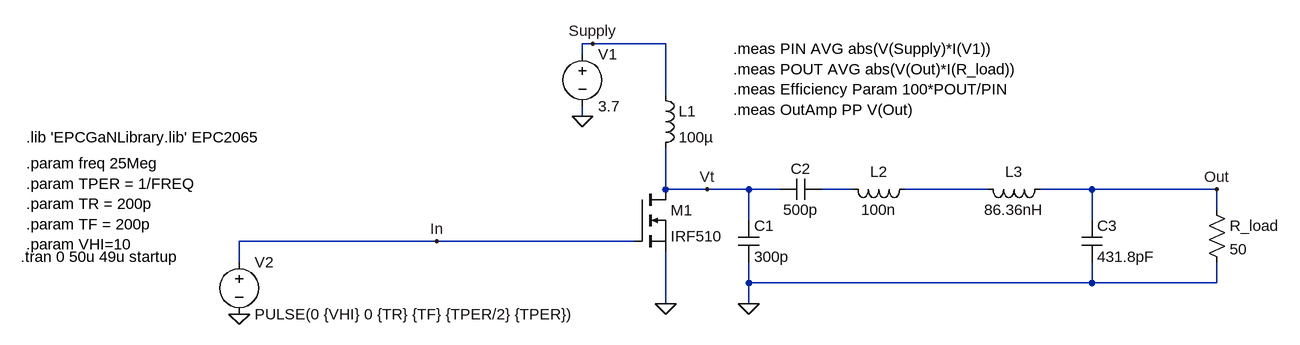
[diagram p0: schematic Class_E_rev1.asc]
Class_E_rev1.asc, the LTspice schematic file:
Version 4.1
SHEET 1 1096 800
WIRE 32 -96 16 -96
WIRE 144 -96 32 -96
WIRE 16 -80 16 -96
WIRE 144 -16 144 -96
WIRE 16 16 16 0
WIRE 144 128 144 64
WIRE 208 128 144 128
WIRE 272 128 208 128
WIRE 320 128 272 128
WIRE 432 128 384 128
WIRE 640 128 512 128
WIRE 800 128 720 128
WIRE 992 128 800 128
WIRE 992 160 992 128
WIRE 272 176 272 128
WIRE 800 176 800 128
WIRE -208 208 -512 208
WIRE 96 208 -208 208
WIRE -512 240 -512 208
WIRE 272 272 272 240
WIRE 800 272 800 240
WIRE 800 272 272 272
WIRE 992 272 992 240
WIRE 992 272 800 272
WIRE 144 304 144 224
WIRE 272 304 272 272
FLAG 16 16 0
FLAG -512 320 0
FLAG 272 304 0
FLAG -208 208 In
FLAG 208 128 Vt
FLAG 32 -96 Supply
FLAG 144 304 0
FLAG 992 128 Out
SYMBOL voltage 16 -96 R0
WINDOW 123 0 0 Left 0
WINDOW 39 0 0 Left 0
SYMATTR InstName V1
SYMATTR Value 3.7
SYMBOL voltage -512 224 R0
WINDOW 123 0 0 Left 0
WINDOW 39 0 0 Left 0
SYMATTR InstName V2
SYMATTR Value PULSE(0 {VHI} 0 {TR} {TF} {TPER/2} {TPER})
SYMBOL ind 128 -32 R0
SYMATTR InstName L1
SYMATTR Value 100µ
SYMBOL cap 384 112 R90
WINDOW 0 0 32 VBottom 2
WINDOW 3 32 32 VTop 2
SYMATTR InstName C2
SYMATTR Value 500p
SYMBOL ind 528 112 R90
WINDOW 0 5 56 VBottom 2
WINDOW 3 32 56 VTop 2
SYMATTR InstName L2
SYMATTR Value 100n
SYMBOL nmos 96 128 R0
SYMATTR InstName M1
SYMATTR Value IRF510
SYMBOL cap 256 176 R0
SYMATTR InstName C1
SYMATTR Value 300p
SYMBOL ind 736 112 R90
WINDOW 0 5 56 VBottom 2
WINDOW 3 32 56 VTop 2
SYMATTR InstName L3
SYMATTR Value 86.36nH
SYMBOL cap 784 176 R0
SYMATTR InstName C3
SYMATTR Value 431.8pF
SYMBOL res 976 144 R0
SYMATTR InstName R_load
SYMATTR Value 50
TEXT -848 232 Left 2 !.tran 0 50u 49u startup
TEXT -840 88 Left 2 !.param freq 25Meg\n.param TPER = 1/FREQ\n.param TR = 200p\n.param TF = 200p\n.param VHI=10
TEXT 248 -88 Left 2 !.meas PIN AVG abs(V(Supply)*I(V1))\n.meas POUT AVG abs(V(Out)*I(R_load))\n.meas Efficiency Param 100*POUT/PIN\n.meas OutAmp PP V(Out)
TEXT -840 48 Left 2 !.lib 'EPCGaNLibrary.lib' EPC2065

The netlist it stands for:
* Class_E_rev1.asc
V1 Supply 0 3.7
V2 In 0 PULSE(0 {VHI} 0 {TR} {TF} {TPER/2} {TPER})
L1 Supply Vt 100µ
C2 N001 Vt 500p
L2 N002 N001 100n
M1 Vt In 0 0 IRF510
C1 Vt 0 300p
L3 Out N002 86.36nH
C3 Out 0 431.8pF
R_load Out 0 50
.model NMOS NMOS
.model PMOS PMOS
.lib standard.mos
.tran 0 50u 49u startup
.param freq 25Meg
.param TPER = 1/FREQ
.param TR = 200p
.param TF = 200p
.param VHI=10
.meas PIN AVG abs(V(Supply)*I(V1))
.meas POUT AVG abs(V(Out)*I(R_load))
.meas Efficiency Param 100*POUT/PIN
.meas OutAmp PP V(Out)
.lib 'EPCGaNLibrary.lib' EPC2065
.backanno
.end